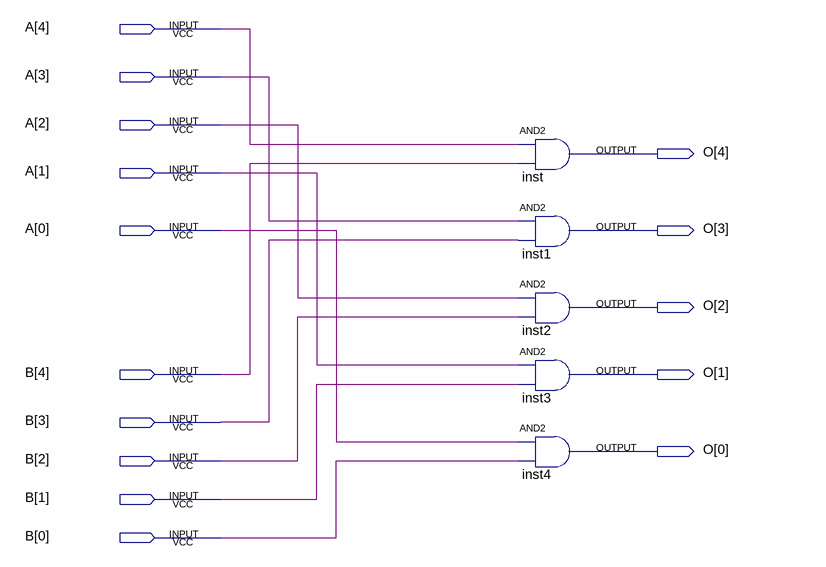
[diagram p0: schematic sheet]
// Quartus schematic BitToBitAND.bdf as structural Verilog: 5 symbols, 15 pins
module BitToBitAND (
  input  [4:0] A,
  input  [4:0] B,
  output [4:0] O
);

  and inst (O[4], A[4], B[4]);
  and inst1 (O[3], A[3], B[3]);
  and inst2 (O[2], A[2], B[2]);
  and inst3 (O[1], A[1], B[1]);
  and inst4 (O[0], A[0], B[0]);
endmodule
